# Altium project 1kW_BLDC_Controller.PrjPcb (part 2 of 2)

## Sheet optocouplers2.SchDoc
size A4; SheetNumber: 6; SheetTotal: 8
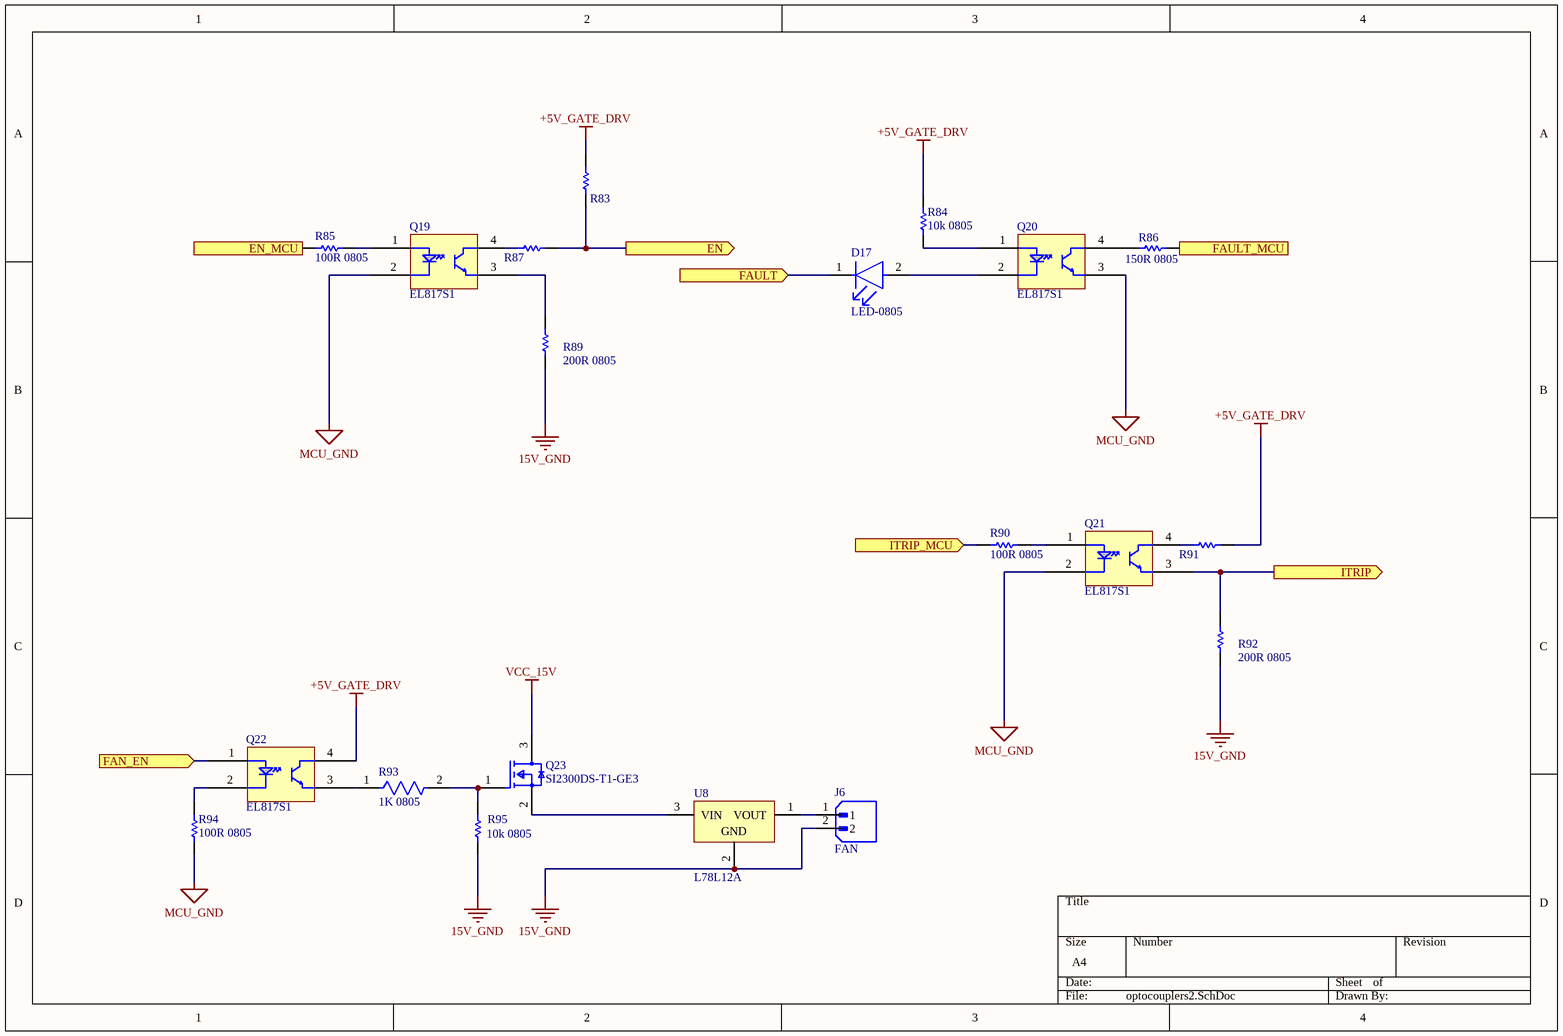
[diagram p5: optocouplers2.SchDoc]

### Parts
D17  LED-0805  [LED0805]
J6  FAN  [XH2.5-2p]
Q19  EL817S1  [EL817S1]
Q20  EL817S1  [EL817S1]
Q21  EL817S1  [EL817S1]
Q22  EL817S1  [EL817S1]
Q23  SI2300DS-T1-GE3  [FP-S-03946-MFG]
R83  0R 0603  [R0603]  (value not drawn)
R84  10k 0805  [R0805]
R85  100R 0805  [R0805]
R86  150R 0805  [R0805]
R87  0R 0603  [R0603]  (value not drawn)
R89  200R 0805  [R0805]
R90  100R 0805  [R0805]
R91  0R 0603  [R0603]  (value not drawn)
R92  200R 0805  [R0805]
R93  1K 0805  [R0805]
R94  100R 0805  [R0805]
R95  10k 0805  [R0805]
U8  L78L12A  [SOT-89_L]

### Ports
EN (out), EN_MCU (in), FAN_EN (in), FAULT (in), FAULT_MCU (out), ITRIP (out), ITRIP_MCU (in)

### Nets
15V_GND: J6.2 R89.1 R92.1 R95.1 U8.2(GND)
+5V_GATE_DRV: Q22.4(C) R83.2 R84.2 R91.2
MCU_GND: Q19.2(K) Q20.3(E) Q21.2(K) R94.1
VCC_15V: Q23.3(D)
NetD17_1: D17.1(C) ; port FAULT
NetD17_2: D17.2(A) Q20.2(K)
NetJ6_1: J6.1 U8.1(VOUT)
NetQ19_1: Q19.1(A) R85.2
NetQ19_3: Q19.3(E) R89.2
NetQ19_4: Q19.4(C) R87.1
NetQ20_1: Q20.1(A) R84.1
NetQ20_4: Q20.4(C) R86.1
NetQ21_1: Q21.1(A) R90.2
NetQ21_3: Q21.3(E) R92.2 ; port ITRIP
NetQ21_4: Q21.4(C) R91.1
NetQ22_1: Q22.1(A) ; port FAN_EN
NetQ22_2: Q22.2(K) R94.2
NetQ22_3: Q22.3(E) R93.1
NetQ23_1: Q23.1(G) R93.2 R95.2
NetQ23_2: Q23.2(S) U8.3(VIN)
NetR32_1: R83.1 R87.2 ; port EN
NetR39_2: R90.1 ; port ITRIP_MCU
NetR85_1: R85.1 ; port EN_MCU
NetR86_2: R86.2 ; port FAULT_MCU

### Library data of the parts
D17 = LED-0805: Red LED – 0805 SMD Package – 17-21SURC/S530-A3/TR8; Price per piece: 2.32; Product URL: https://sharvielectronics.com/product/red-led-0805-smd-package-17-21surc-s530-a3-tr8/; Datasheet: https://drive.google.com/file/d/193qGY45iPx2JlzACJk7ZLn2axHlG04VY/view?usp=sharing
J6 = XH2.5-2p: 2 Pin JST-XH Male Straight 2515 Connector 2.54mm Pitch; Price per piece: 1.65; Product URL: https://sharvielectronics.com/product/2-pin-jst-xh-male-straight-2515-connector-2-54mm-pitch/; Datasheet: https://sharvielectronics.com/wp-content/uploads/2021/01/XH-Connector.pdf
Q19-Q22 = EL817S1: EL817S1 (B) (TU) – F Optocoupler SMD-4 Cut Tape; Product URL: https://sharvielectronics.com/product/el817s1-b-tu-f-optocoupler-smd-4-cut-tape/; Price per piece: 7.45; Datasheet: https://sharvielectronics.com/wp-content/uploads/2021/09/EL817-Optocoupler.pdf
Q23 = CMP-02550-000182-1: SI2300DS 30V 3.6A N-Channel Mosfet – SOT-23 Package; Manufacturer: Vishay; Threshold Vgs Max: 1.5V; Max Forward Diode Voltage: 1.2V; Max Junction Temp: +150°C; Reverse Recovery Time: 11ns; Depletion Mode: False; Standoff Height: 0.01mm; Gate To Source Voltage: 12V; Input Capacitace At Vds: 320pF @ 15V; Turn Off Delay Time: 15ns; Threshold Vgs Min: 0.6V; Transconductance: 13S; Gate Charge At Vgs: 6.5nC @ 10V; Power Dissipation: 1.1W; Drain To Source Resistance: 0.055Ω; Number Of N Channels: 1; Pulse Drain Current: 15A; Continuous Drain Current: 3.1A; Typ Forward Diode Voltage: 0.8V; Reverse Recovery Charge: 5nC; Rthja Max: 90°C/W; Turn On Delay Time: 5ns; Device Class L2: Transistors; Digikey Description: MOSFET N-CH 30V 3.6A SOT-23; Device Class L3: MOSFETs; ComponentLink2Description: Datasheet; Height: 1.12mm; Temperature Range Low: -55°C; Package: S-03946; Device Class L1: Discrete Semiconductors; RoHS: TRUE; ComponentLink2URL: http://www.vishay.com/docs/65701/si2300ds.pdf; Category: Trans; Drain To Source Breakdown Voltage: 30V; Automotive: No; Number Of Channels: 1; Mouser Description: MOSFET 30V 3.6A N-CH MOSFET; Temperature: -55°C to +150°C; Manufacturer Part Number: SI2300DS-T1-GE3; Octopart: https://octopart.com/si2300ds-t1-ge3-vishay-44451512; Drain To Source Voltage: 30V; Lead Free: Yes; Temperature Range High: +150°C; Ipc Land Pattern Name: SOT95P237X100-3; Price per piece: 12.5; Product URL: https://sharvielectronics.com/product/si2300ds-30v-3-6a-n-channel-mosfet-sot-23-package/; Datasheet: https://www.vishay.com/docs/65701/si2300ds.pdf
R83 R87 R91 = R0000 0603: 0 Ohm 1/10 Watt Resistor 1% Tolerance RC0603FR-070RL – 0603 Package; Price per piece: 0.97; Product URL: https://sharvielectronics.com/product/0-ohm-1-10-watt-resistor-1-tolerance-rc0603fr-070rl-0603-package/; Datasheet: https://drive.google.com/file/d/1pkLQT_RQ1i35oFQcGREpZr7Oy3Ppi-ZT/view?usp=sharing
R84 R95 = 10k 0805: 10K Ohm 1/8 Watt Resistor 1% Tolerance RC0805FR-0710KL – 0805 Package; Price per piece: 0.82; Product URL: https://sharvielectronics.com/product/10k-ohm-1-8-watt-resistor-1-tolerance-rc0805fr-0710kl-0805-package/; Datasheet: https://drive.google.com/file/d/1pkLQT_RQ1i35oFQcGREpZr7Oy3Ppi-ZT/view?usp=sharing
R85 R90 R94 = 100R 0805: 100 ohm 1/4W Resistor 0805 Package; Price per piece: 0.82; Product URL: https://sharvielectronics.com/product/100-ohm-1-4w-resistor-0805-package/; Datasheet: *
R86 = R0805: 510 Ohm 1/8 Watt Resistor 1% Tolerance 0805S8F5100T5E – 0805 Package; Price per piece: 0.85; Product URL: https://sharvielectronics.com/product/510-ohm-1-8-watt-resistor-1-tolerance-0805s8f5100t5e-0805-package/; Datasheet: https://drive.google.com/file/d/1rtx85iFJaMrDbsv7PAzG9bTFItPmAE38/view
R89 R92 = R0805: 200 Ohm 1/8 Watt Resistor 1% Tolerance 0805W8F2000TE – 0805 Package; Price per piece: 0.82; Product URL: https://sharvielectronics.com/product/200-ohm-1-8-watt-resistor-1-tolerance-0805w8f2000te-0805-package/; Datasheet: https://drive.google.com/file/d/1rtx85iFJaMrDbsv7PAzG9bTFItPmAE38/view?usp=sharing
R93 = 1k 0805: 1K Ohm 1/8 Watt Resistor 1% Tolerance 0805S8F1001T5E – 0805 Package; Price per piece: 0.82; Product URL: https://sharvielectronics.com/product/1k-ohm-1-8-watt-resistor-1-tolerance-0805s8f1001t5e-0805-package/; Datasheet: https://drive.google.com/file/d/1rtx85iFJaMrDbsv7PAzG9bTFItPmAE38/view?usp=sharing
U8 = CMP-0244-00387-1: 78L12 – 12V 150mA Positive Voltage Regulator-SOT-89 Package; DatasheetVersion: 1/02/2011; PackageDescription: 3-Pin SOT-89 Package 1.5 mm Pitch, 4.1 mm Lead Span; ComponentLink2Description: Datasheet; ComponentLink1Description: Manufacturer URL; PackageVersion: 2011; PackageReference: SOT-89; ComponentLink1URL: http://www.st.com; ComponentLink2URL: http://www.st.com/internet/com/TECHNICAL_RESOURCES/TECHNICAL_LITERATURE/DATASHEET/CD00000446.pdf; Price per piece: 13.32; Product URL: https://sharvielectronics.com/product/78l12-12v-150ma-positive-voltage-regulator-sot-89-package/; Datasheet: https://drive.google.com/file/d/1zOSy_FqMAdv1iXKmyJwn0G3RjMYeVW2a/view?usp=sharing

## Sheet Precharge circuit.SchDoc
size A4; SheetNumber: 7; SheetTotal: 8
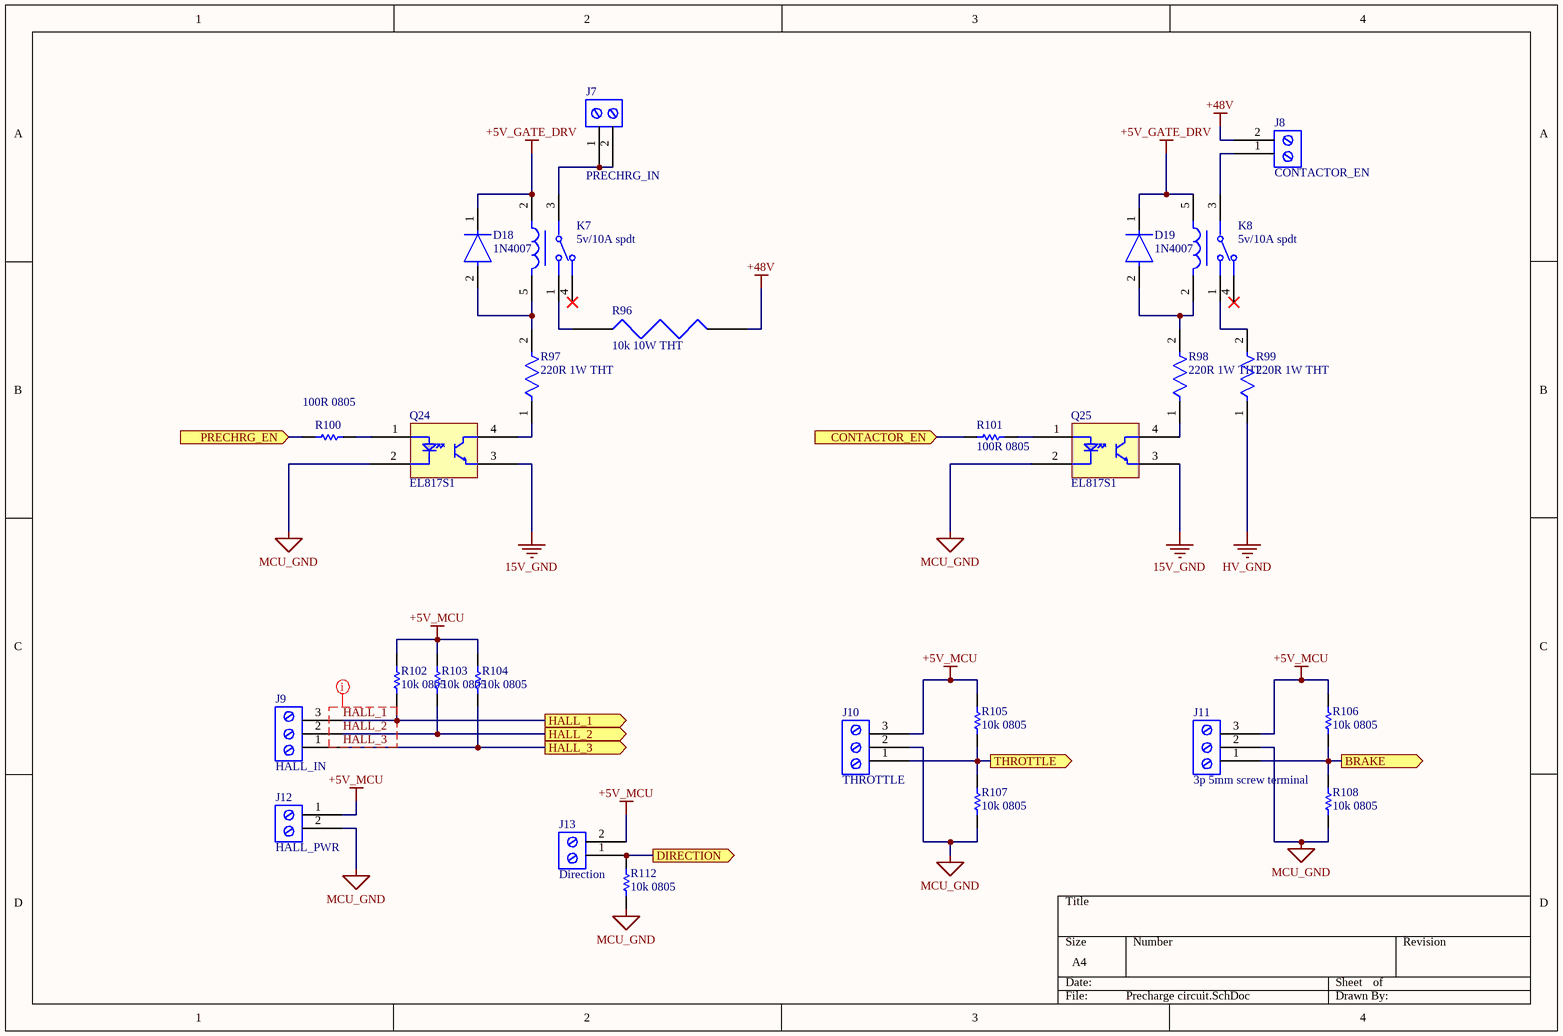
[diagram p6: Precharge circuit.SchDoc]

### Parts
D18  1N4007  [FP-1N4007-MFG]
D19  1N4007  [FP-1N4007-MFG]
J7  PRECHRG_IN  [TERMINAL_5MM_2P]
J8  CONTACTOR_EN  [TERMINAL_5MM_2P]
J9  HALL_IN  [TERMINAL_5MM_3P]
J10  THROTTLE  [TERMINAL_5MM_3P]
J11  3p 5mm screw terminal  [TERMINAL_5MM_3P]
J12  HALL_PWR  [TERMINAL_5MM_2P]
J13  Direction  [TERMINAL_5MM_2P]
K7  5v/10A spdt  [FP-G5LE-1-E-36-DC5-MFG]
K8  5v/10A spdt  [FP-G5LE-1-E-36-DC5-MFG]
Q24  EL817S1  [EL817S1]
Q25  EL817S1  [EL817S1]
R96  10k 10W THT  [R10W]
R97  220R 1W THT  [R1WTHT]
R98  220R 1W THT  [R1WTHT]
R99  220R 1W THT  [R1WTHT]
R100  100R 0805  [R0805]
R101  100R 0805  [R0805]
R102  10k 0805  [R0805]
R103  10k 0805  [R0805]
R104  10k 0805  [R0805]
R105  10k 0805  [R0805]
R106  10k 0805  [R0805]
R107  10k 0805  [R0805]
R108  10k 0805  [R0805]
R112  10k 0805  [R0805]

### Ports
BRAKE (out), CONTACTOR_EN (in), DIRECTION (out), HALL_1 (out), HALL_2 (out), HALL_3 (out), PRECHRG_EN (in), THROTTLE (out)

### Nets
15V_GND: Q24.3(E) Q25.3(E)
+5V_GATE_DRV: D18.1(C) D19.1(C) K7.2 K8.5
+5V_MCU: J10.3 J11.3 J12.1 J13.2 R102.2 R103.2 R104.2 R105.2 R106.2
+48V: J8.2 R96.2
HV_GND: R99.1  [project net COM]
MCU_GND: J10.2 J11.2 J12.2 Q24.2(K) Q25.2(K) R107.1 R108.1 R112.1
HALL_1: J9.3 R102.1 ; port HALL_1
HALL_2: J9.2 R103.1 ; port HALL_2
HALL_3: J9.1 R104.1 ; port HALL_3
NetD18_2: D18.2(A) K7.5 R97.2
NetD19_2: D19.2(A) K8.2 R98.2
NetJ7_1: J7.1 J7.2 K7.3
NetJ8_1: J8.1 K8.3
NetJ10_1: J10.1 R105.1 R107.2 ; port THROTTLE
NetJ11_1: J11.1 R106.1 R108.2 ; port BRAKE
NetJ13_1: J13.1 R112.2 ; port DIRECTION
NetK7_1: K7.1 R96.1
NetK8_1: K8.1 R99.2
NetQ24_1: Q24.1(A) R100.2
NetQ24_4: Q24.4(C) R97.1
NetQ25_1: Q25.1(A) R101.2
NetQ25_4: Q25.4(C) R98.1
NetR100_1: R100.1 ; port PRECHRG_EN
NetR101_1: R101.1 ; port CONTACTOR_EN

Not connected (* = marked no-connect by the designer): K7 4*; K8 4*

### Layout directives
rule Matched Net Lengths [Tolerance = 1mm]; net class HALL: HALL_1, HALL_2, HALL_3

### Library data of the parts
D18 D19 = CMP-123542-000001-1: GOOD-ARK 1N4007 General Purpose Rectifier Diode – DO-41 Package; Manufacturer: Diotec; Max Surge Forward Current: 27A; Forward Current: 1A; Max Junction Temp: +175°C; Reverse Voltage: 1000V; Value: 15pF; Peak Reverse Current: 5uA; Category: Diode; Temperature Range Low: -50°C; Automotive: No; Temperature: -50°C to +175°C; Lead Free: Yes; ComponentLink2Description: Datasheet; Max Repetitive Reverse Voltage: 1000V; ComponentLink2URL: https://datasheet.octopart.com/1N4007-Diotec-datasheet-62346875.pdf; Manufacturer Part Number: 1N4007; Device Class L3: Rectifier Diodes; Height: 2.8mm; Octopart: https://octopart.com/1n4007-diotec-4040411; Package: 1N4007; Temperature Range High: +175°C; Device Class L1: Discrete Semiconductors; Device Class L2: Diodes; RoHS: TRUE; Capacitance: 15pF; Ipc Land Pattern Name: DIOAD888W100L520D280; Product URL: https://sharvielectronics.com/product/good-ark-1n4007-general-purpose-rectifier-diode-do-41-package/; Price per piece: 1.29; Datasheet: https://sharvielectronics.com/wp-content/uploads/2020/02/1N4007-Diode-Good-Ark.pdf
J7 J8 J12 J13 = 2p 5mm screw terminal: XY127- 2 Pin Screw Terminal- 5mm Pitch; Product URL: https://sharvielectronics.com/product/2-pin-screw-terminal-block-red-5mm-pitch/; Price per piece: 6.32; Datasheet: https://sharvielectronics.com/wp-content/uploads/2023/03/XY127.pdf
J9-J11 = 3p 5mm screw terminal: XY127- 3 Pin Screw Terminal- 5mm Pitch; Product URL: https://sharvielectronics.com/product/xy127-3-pin-screw-terminal-5mm-pitch/; Price per piece: 8.35; Datasheet: https://sharvielectronics.com/wp-content/uploads/2023/03/XY127.pdf
K7 K8 = CMP-08822-000056-1: HF3FF/005-1ZST – 05V 10A SPDT Relay – Hongfa; Coil Voltage (DC): 5V; Coil Type: Non-Latching; Relay Type: General Purpose; Power Consumption: 400mW; Coil Resistance: 70R; Release Time: 5ms; Coil Current: 72mA; Coil Power: 360mW; Operate Time: 10ms; Contact Current Rating: 16A; Max Operating Temperature: 85°C; Contact Material: Tin; Package Quantity: 100; Throw Configuration: SPDT; Termination: PC Pin; Series: G5LE-E; Packaging: Tray; Min Operating Temperature: -40°C; Mount: Through Hole; Price per piece: 29.23; Product URL: https://sharvielectronics.com/product/hf3ff-005-1zst-05v-10a-spdt-relay-hongfa/; Datasheet: https://drive.google.com/file/d/1_hoLs5DHKocXjc-HuLXelOv-fi3k6HGm/view?usp=sharing
Q24 Q25 = EL817S1: as Q19 on sheet optocouplers2; Product URL: https://sharvielectronics.com/product/el817s1-b-tu-f-optocoupler-smd-4-cut-tape/; Price per piece: 7.45; Datasheet: https://sharvielectronics.com/wp-content/uploads/2021/09/EL817-Optocoupler.pdf
R96 = 10k_10W_THT: 10K ohm 10W Fusible Cement Resistor; Price per piece: 20; Product URL: https://sharvielectronics.com/product/10k-ohm-10w-fusible-cement-resistor/; Datasheet: *
R97-R99 = 220R 1W THT: 220 Ohm 1 Watt Resistor 5% Tolerance; Price per piece: 1.46; Product URL: https://sharvielectronics.com/product/220-ohm-1-watt-resistor-5-tolerance/; Datasheet: *
R100 R101 = 100R 0805: 100 ohm 1/4W Resistor 0805 Package; Price per piece: 0.82; Product URL: https://sharvielectronics.com/product/100-ohm-1-4w-resistor-0805-package/; Datasheet: *
R102-R108 R112 = 10k 0805: as R84 on sheet optocouplers2; Price per piece: 0.82; Product URL: https://sharvielectronics.com/product/10k-ohm-1-8-watt-resistor-1-tolerance-rc0805fr-0710kl-0805-package/; Datasheet: https://drive.google.com/file/d/1pkLQT_RQ1i35oFQcGREpZr7Oy3Ppi-ZT/view?usp=sharing

## Sheet mcu.SchDoc
size A4; SheetNumber: 8; SheetTotal: 8
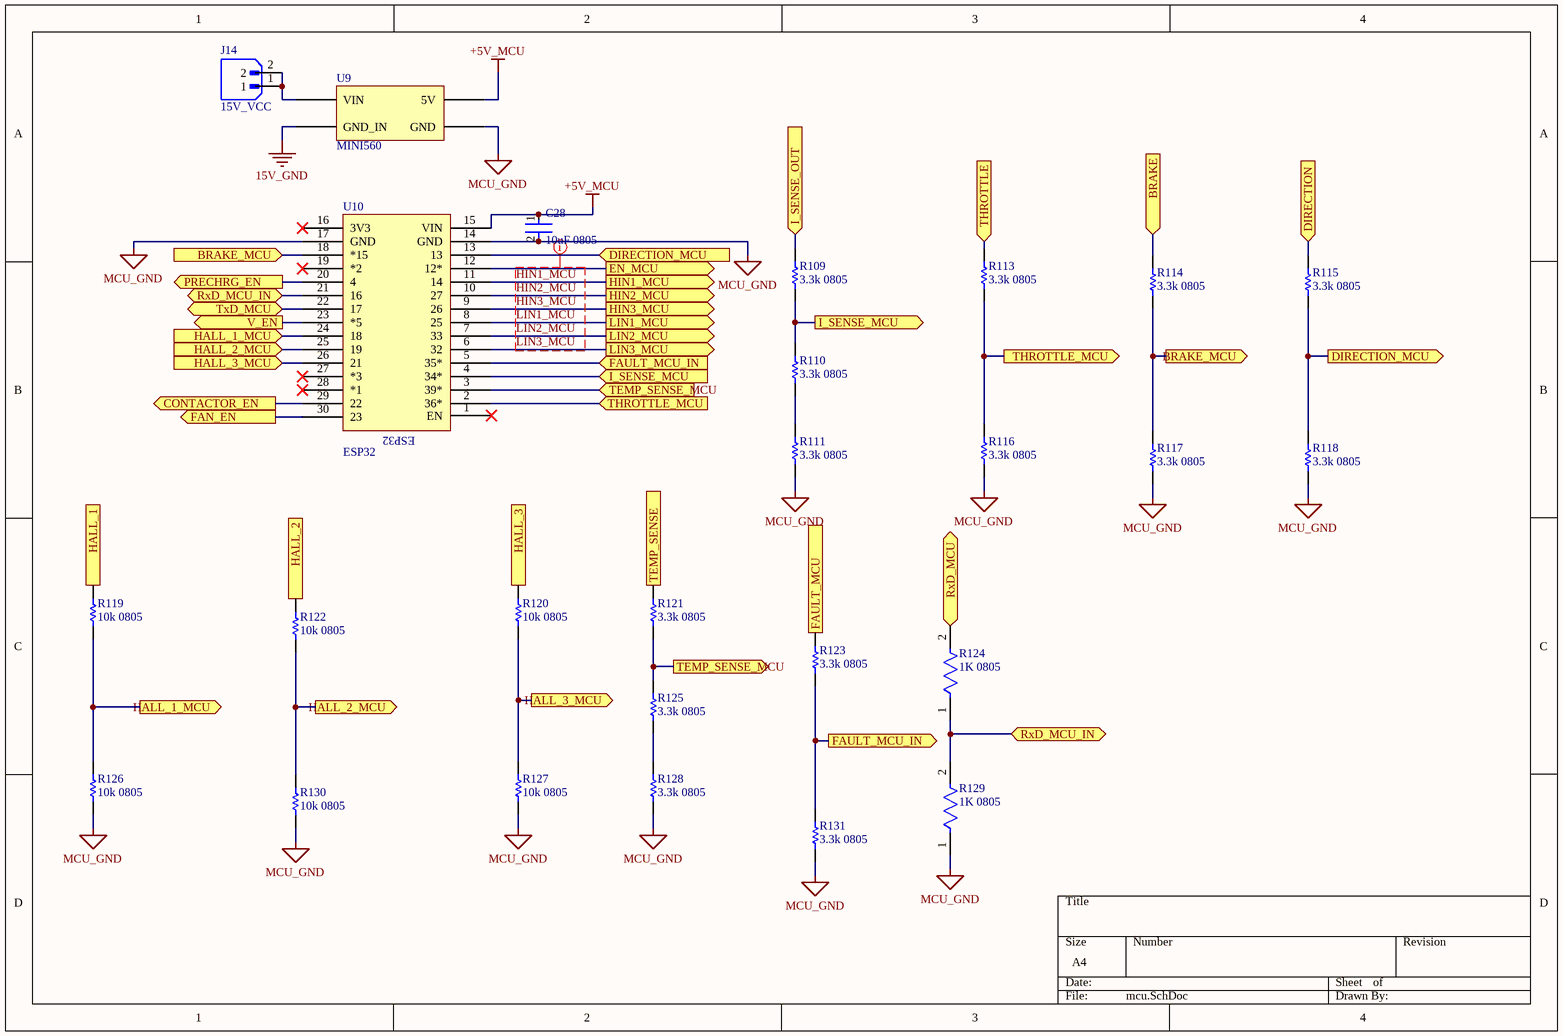
[diagram p7: mcu.SchDoc]

### Parts
C28  10uF 0805  [R0805]
J14  15V_VCC  [XH2.5-2p]
R109  3.3k 0805  [R0805]
R110  3.3k 0805  [R0805]
R111  3.3k 0805  [R0805]
R113  3.3k 0805  [R0805]
R114  3.3k 0805  [R0805]
R115  3.3k 0805  [R0805]
R116  3.3k 0805  [R0805]
R117  3.3k 0805  [R0805]
R118  3.3k 0805  [R0805]
R119  10k 0805  [R0805]
R120  10k 0805  [R0805]
R121  3.3k 0805  [R0805]
R122  10k 0805  [R0805]
R123  3.3k 0805  [R0805]
R124  1K 0805  [R0805]
R125  3.3k 0805  [R0805]
R126  10k 0805  [R0805]
R127  10k 0805  [R0805]
R128  3.3k 0805  [R0805]
R129  1K 0805  [R0805]
R130  10k 0805  [R0805]
R131  3.3k 0805  [R0805]
U9  MINI560  [MINI560]
U10  ESP32  [esp32]

### Ports
BRAKE (in), BRAKE_MCU (in), BRAKE_MCU (out), CONTACTOR_EN (out), DIRECTION (in), DIRECTION_MCU (in), DIRECTION_MCU (out), EN_MCU (out), FAN_EN (out), FAULT_MCU (in), FAULT_MCU_IN (in), FAULT_MCU_IN (out), HALL_1 (in), HALL_1_MCU (in), HALL_1_MCU (out), HALL_2 (in), HALL_2_MCU (in), HALL_2_MCU (out), HALL_3 (in), HALL_3_MCU (in), HALL_3_MCU (out), HIN1_MCU (out), HIN2_MCU (out), HIN3_MCU (out), I_SENSE_MCU (in), I_SENSE_MCU (out), I_SENSE_OUT (in), LIN1_MCU (out), LIN2_MCU (out), LIN3_MCU (out), PRECHRG_EN (out), RxD_MCU (bidir), RxD_MCU_IN (bidir), TEMP_SENSE (in), TEMP_SENSE_MCU (in), TEMP_SENSE_MCU (out), THROTTLE (in), THROTTLE_MCU (in), THROTTLE_MCU (out), TxD_MCU (bidir), V_EN (out)

### Nets
15V_GND: U9.2(GND_IN)
+5V_MCU: C28.1 U9.3(5V) U10.15(VIN)
MCU_GND: C28.2 R111.1 R116.1 R117.1 R118.1 R126.1 R127.1 R128.1 R129.1 R130.1 R131.1 U9.4(GND) U10.14(GND) U10.17(GND)
HALL_1: R119.2 ; port HALL_1
HALL_2: R122.2 ; port HALL_2
HALL_3: R120.2 ; port HALL_3
HIN1_MCU: U10.11(14) ; port HIN1_MCU
HIN2_MCU: U10.10(27) ; port HIN2_MCU
HIN3_MCU: U10.9(26) ; port HIN3_MCU
LIN1_MCU: U10.8(25) ; port LIN1_MCU
LIN2_MCU: U10.7(33) ; port LIN2_MCU
LIN3_MCU: U10.6(32) ; port LIN3_MCU
NetC18_1: R121.2 ; port TEMP_SENSE
NetJ10_1: R113.2 ; port THROTTLE
NetJ11_1: R114.2 ; port BRAKE
NetJ13_1: R115.2 ; port DIRECTION
NetJ14_1: J14.1 J14.2 U9.1(VIN)
NetQ22_1: U10.30(23) ; port FAN_EN
NetR38_2: R109.2 ; port I_SENSE_OUT
NetR85_1: U10.12(12*) ; port EN_MCU
NetR86_2: R123.2 ; port FAULT_MCU
NetR100_1: U10.20(4) ; port PRECHRG_EN
NetR101_1: U10.29(22) ; port CONTACTOR_EN
NetR109_1: R109.1 R110.2 U10.4(34*) ; port I_SENSE_MCU
NetR110_1: R110.1 R111.2
NetR113_1: R113.1 R116.2 U10.2(36*) ; port THROTTLE_MCU
NetR114_1: R114.1 R117.2 U10.18(*15) ; port BRAKE_MCU
NetR115_1: R115.1 R118.2 U10.13 ; port DIRECTION_MCU
NetR119_1: R119.1 R126.2 U10.24(18) ; port HALL_1_MCU
NetR120_1: R120.1 R127.2 U10.26(21) ; port HALL_3_MCU
NetR121_1: R121.1 R125.2 U10.3(39*) ; port TEMP_SENSE_MCU
NetR122_1: R122.1 R130.2 U10.25(19) ; port HALL_2_MCU
NetR123_1: R123.1 R131.2 U10.5(35*) ; port FAULT_MCU_IN
NetR124_1: R124.1 R129.2 U10.21(16) ; port RxD_MCU_IN
NetR124_2: R124.2 ; port RxD_MCU
NetR125_1: R125.1 R128.2
NetU7_2: U10.23(*5) ; port V_EN
NetU7_4: U10.22(17) ; port TxD_MCU

Not connected (* = marked no-connect by the designer): U10 1(EN)* 16(3V3)* 19(*2)* 27(*3)* 28(*1)*

### Layout directives
rule Matched Net Lengths [Tolerance = 1mm]; net class PWM: HIN1_MCU, HIN2_MCU, HIN3_MCU, LIN1_MCU, LIN2_MCU, LIN3_MCU

### Library data of the parts
C28 = 10uF 0805: 10uF/1000nF 50V Capacitor ±10% Tolerance CC0805KKX5R9BB106 – 0805 Package; Product URL: https://sharvielectronics.com/product/10uf-1000nf-50v-capacitor-%c2%b110-tolerance-cc0805kkx5r9bb106-0805-package/; Price per piece: 2.85; Datasheet: https://drive.google.com/file/d/1wr2K_YaGqgMtACeU2pC6RWLSxDMrIPxr/view?usp=sharing
J14 = XH2.5-2p: as J6 on sheet optocouplers2; Price per piece: 1.65; Product URL: https://sharvielectronics.com/product/2-pin-jst-xh-male-straight-2515-connector-2-54mm-pitch/; Datasheet: https://sharvielectronics.com/wp-content/uploads/2021/01/XH-Connector.pdf
R109-R111 R113-R118 R121 R123 R125 R128 R131 = R0805: 3.3K Ohm 1/8 Watt Resistor 1% Tolerance RC0805FR-073K3L – 0805 Package; Price per piece: 0.82; Product URL: https://sharvielectronics.com/product/3-3k-ohm-1-8-watt-resistor-1-tolerance-rc0805fr-073k3l-0805-package/; Datasheet: https://drive.google.com/file/d/1pkLQT_RQ1i35oFQcGREpZr7Oy3Ppi-ZT/view?usp=sharing
R119 R120 R122 R126 R127 R130 = 10k 0805: as R84 on sheet optocouplers2; Price per piece: 0.82; Product URL: https://sharvielectronics.com/product/10k-ohm-1-8-watt-resistor-1-tolerance-rc0805fr-0710kl-0805-package/; Datasheet: https://drive.google.com/file/d/1pkLQT_RQ1i35oFQcGREpZr7Oy3Ppi-ZT/view?usp=sharing
R124 R129 = 1k 0805: as R93 on sheet optocouplers2; Price per piece: 0.82; Product URL: https://sharvielectronics.com/product/1k-ohm-1-8-watt-resistor-1-tolerance-0805s8f1001t5e-0805-package/; Datasheet: https://drive.google.com/file/d/1rtx85iFJaMrDbsv7PAzG9bTFItPmAE38/view?usp=sharing
U9 = MINI560: MINI560 5VDC 5A Step-Down Stabilized Module; Price per piece: 125.33; Product URL: https://sharvielectronics.com/product/mini560-5vdc-5a-step-down-stabilized-module/

## Nets that join several sheets
15V_GND: Gate_Driver (14 pins), Optocouplers (6 pins), optocouplers2 (5 pins), Precharge circuit (Q24.3 Q25.3), mcu (U9.2)
+5V_GATE_DRV: Gate_Driver (6 pins), Optocouplers (12 pins), optocouplers2 (Q22.4 R83.2 R84.2 R91.2), Precharge circuit (D18.1 D19.1 K7.2 K8.5)
+5V_MCU: Current_measurement (8 pins), Voltage_measurement (C22.1 C23.1 U7.8), Optocouplers (6 pins), Precharge circuit (9 pins), mcu (C28.1 U9.3 U10.15)
+48V: HV_Side (12 pins), Voltage_measurement (R47.1 R48.2), Precharge circuit (J8.2 R96.2)
COM: HV_Side (17 pins), Gate_Driver (U2.13 U2.17), Voltage_measurement (C29.2 D16.2 R56.1 R88.1), Precharge circuit (R99.1)
MCU_GND: Current_measurement (12 pins), Voltage_measurement (C22.2 C23.2 U7.5), Optocouplers (12 pins), optocouplers2 (Q19.2 Q20.3 Q21.2 R94.1), Precharge circuit (8 pins), mcu (14 pins)
VCC_15V: Gate_Driver (11 pins), optocouplers2 (Q23.3)
H03: HV_Side (D3.1 D6.1 R3.1 R9.1), Gate_Driver (U2.19)
HALL_1: Precharge circuit (J9.3 R102.1), mcu (R119.2)
HALL_2: Precharge circuit (J9.2 R103.1), mcu (R122.2)
HALL_3: Precharge circuit (J9.1 R104.1), mcu (R120.2)
HIN1: Gate_Driver (R26.1), Optocouplers (Q13.6)
HIN1_MCU: Optocouplers (R62.1), mcu (U10.11)
HIN2: Gate_Driver (R28.1), Optocouplers (Q15.6)
HIN2_MCU: Optocouplers (R64.1), mcu (U10.10)
HIN3: Gate_Driver (R30.1), Optocouplers (Q17.6)
HIN3_MCU: Optocouplers (R75.1), mcu (U10.9)
HO1: HV_Side (D1.1 D4.1 R1.1 R7.1), Gate_Driver (U2.27)
HO2: HV_Side (D2.1 D5.1 R2.1 R8.1), Gate_Driver (U2.23)
LIN1: Gate_Driver (R27.1), Optocouplers (Q14.6)
LIN1_MCU: Optocouplers (R63.1), mcu (U10.8)
LIN2: Gate_Driver (R29.1), Optocouplers (Q16.6)
LIN2_MCU: Optocouplers (R74.1), mcu (U10.7)
LIN3: Gate_Driver (R31.1), Optocouplers (Q18.6)
LIN3_MCU: Optocouplers (R76.1), mcu (U10.6)
LO1: HV_Side (D7.1 D10.1 R13.1 R19.1), Gate_Driver (U2.16)
LO2: HV_Side (D8.1 D11.1 R14.1 R20.1), Gate_Driver (U2.15)
LO3: HV_Side (D9.1 D12.1 R15.1 R21.1), Gate_Driver (U2.14)
NetC18_1: Current_measurement (C18.1 R42.2 U3.7), mcu (R121.2)
NetD17_1: Gate_Driver (R33.1), optocouplers2 (D17.1)
NetJ10_1: Precharge circuit (J10.1 R105.1 R107.2), mcu (R113.2)
NetJ11_1: Precharge circuit (J11.1 R106.1 R108.2), mcu (R114.2)
NetJ13_1: Precharge circuit (J13.1 R112.2), mcu (R115.2)
NetQ21_3: Gate_Driver (U2.9), optocouplers2 (Q21.3 R92.2)
NetQ22_1: optocouplers2 (Q22.1), mcu (U10.30)
NetR32_1: Gate_Driver (R32.1), optocouplers2 (R83.1 R87.2)
NetR38_2: Current_measurement (R38.2), mcu (R109.2)
NetR39_2: Current_measurement (R39.2 R41.2), optocouplers2 (R90.1)
NetR85_1: optocouplers2 (R85.1), mcu (U10.12)
NetR86_2: optocouplers2 (R86.2), mcu (R123.2)
NetR100_1: Precharge circuit (R100.1), mcu (U10.20)
NetR101_1: Precharge circuit (R101.1), mcu (U10.29)
NetR124_2: Voltage_measurement (U7.1), mcu (R124.2)
NetU7_2: Voltage_measurement (U7.2 U7.3), mcu (U10.23)
NetU7_4: Voltage_measurement (U7.4), mcu (U10.22)
PHASE_A: HV_Side (7 pins), Gate_Driver (C3.2 U2.26)
PHASE_B: HV_Side (7 pins), Gate_Driver (C4.2 U2.22)
PHASE_C: HV_Side (7 pins), Gate_Driver (C6.2 U2.18)